# EAGLE design boost (EAGLE 9.1.0)
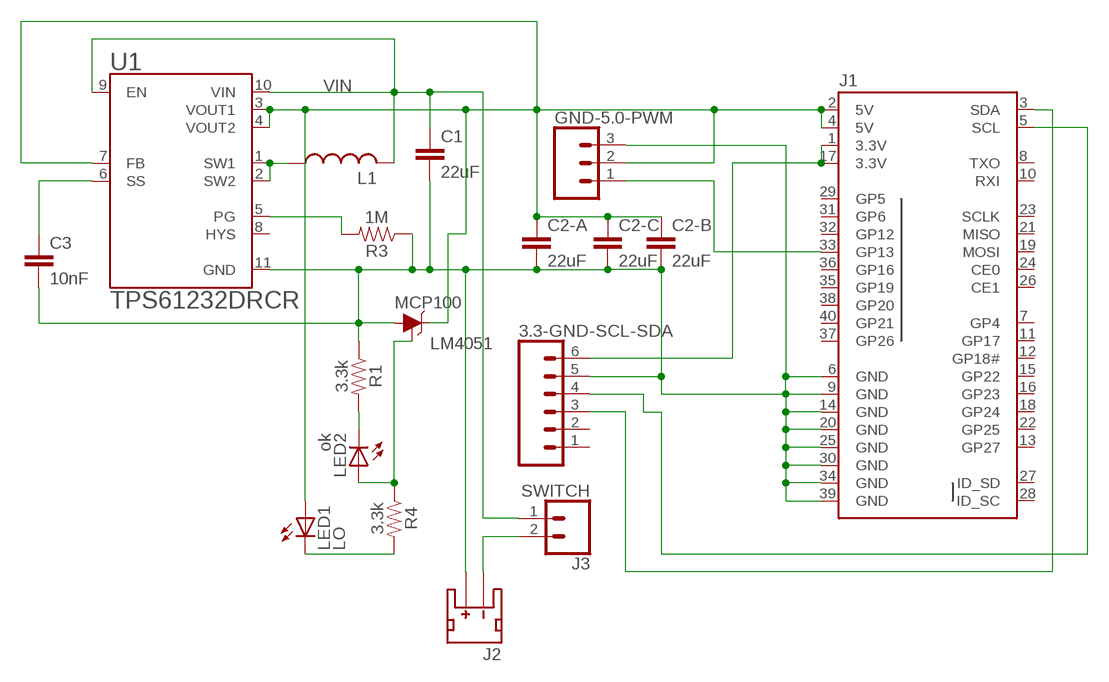
[diagram p0: schematic, sheet 1]

## Parts
3.3-GND-SCL-SDA  CONN_06POLAR  [MOLEX-1X6]
C1  22uF  C-EUC0603  [C0603]
C2-A  22uF  C-EUC0603  [C0603]
C2-B  22uF  C-EUC0603  [C0603]
C2-C  22uF  C-EUC0603  [C0603]
C3  10nF  C-EUC0603  [C0603]
GND-5.0-PWM  CONN_03  [1X03]
J1  RASPBERRYPI-40-PIN-GPIO_PTH_NO_SHROUD  [2X20]
J2  PWR  JST_2MM_MALE  [JST-2-SMD]
J3  SWITCH  CONN_02  [1X02]
L1  L-USL4532C  [L4532M]
LED1  LO  LEDCHIP-LED0603  [CHIP-LED0603]
LED2  ok  LEDCHIP-LED0603  [CHIP-LED0603]
MCP100  LM4051  [SOT23-3]
R1  3.3k  3.3KOHM-0603-1/10W-1%  [0603]
R3  1M  1.5KOHM-0603-1/10W-1%  [0603]
R4  3.3k  3.3KOHM-0603-1/10W-1%  [0603]
U1  TPS61232DRCR  [SON50P300X300X100-10N]

## Nets
GND: 3.3-GND-SCL-SDA.5 C1.2 C2-A.2 C2-B.2 C2-C.2 C3.2 GND-5.0-PWM.3 J1.6(GND) J1.9(GND) J1.14(GND) J1.20(GND) J1.25(GND) J1.30(GND) J1.34(GND) J1.39(GND) J2.2(+) MCP100.3(A) R1.1 R3.1 U1.11(GND)
N$1: LED2.C R1.2
N$4: LED2.A MCP100.1(ADJ) R4.1
N$9: GND-5.0-PWM.1 J1.33(GP13)
N$13: LED1.C R4.2
N$22: J2.1(-) J3.2
PG: R3.2 U1.5(PG)
SCL: 3.3-GND-SCL-SDA.4 J1.5(SCL)
SDA: 3.3-GND-SCL-SDA.3 J1.3(SDA)
SS: C3.1 U1.6(SS)
SW: L1.1 U1.1(SW1) U1.2(SW2)
V33: 3.3-GND-SCL-SDA.6 J1.1(3.3V) J1.17(3.3V)
VIN: C1.1 J3.1 L1.2 U1.9(EN) U1.10(VIN)
VOUT: C2-A.1 C2-B.1 C2-C.1 GND-5.0-PWM.2 J1.2(5V) J1.4(5V) LED1.A MCP100.2(C) U1.3(VOUT1) U1.4(VOUT2) U1.7(FB)
Unconnected: 3.3-GND-SCL-SDA.1 3.3-GND-SCL-SDA.2 J1.7(GP4) J1.8(TXO) J1.10(RXI) J1.11(GP17) J1.12(GP18#) J1.13(GP27) J1.15(GP22) J1.16(GP23) J1.18(GP24) J1.19(MOSI) J1.21(MISO) J1.22(GP25) J1.23(SCLK) J1.24(CE0) J1.26(CE1) J1.27(ID_SD) J1.28(ID_SC) J1.29(GP5) J1.31(GP6) J1.32(GP12) J1.35(GP19) J1.36(GP16) J1.37(GP26) J1.38(GP20) J1.40(GP21) J2.NC1(PAD1) J2.NC2(PAD2) U1.8(HYS)

## Library data of the parts
3.3-GND-SCL-SDA = SparkFun-Connectors:CONN_06: Multi connection point. Often used as Generic Header-pin footprint for 0.1 inch spaced/style header connections On any of the 0.1 inch spaced packages, you can populate with these: Break Away Headers - Straight <https://www.sparkfun.com/products/116> (PRT-00116) Break Away Male Headers - Right Angle <https://www.sparkfun.com/products/553> (PRT-00553) Female Headers <https://www.sparkfun.com/products/115> (PRT-00115) Break Away Headers - Machine Pin <https://www.sparkfun.com/products/117> (PRT-00117) Break Away Female Headers - Swiss Machine Pin <https://www.sparkfun.com/products/743> (PRT-00743) Arduino Stackable Header - 6 Pin <https://www.sparkfun.com/products/9280> (PRT-09280) For SCREWTERMINALS and SPRING TERMINALS visit here: Screw Terimnals on SparkFun.com <https://www.sparkfun.com/search/results?term=Screw+Terminals> (5mm/3.5mm/2.54mm spacing) This device is also useful as a general connection point to wire up your design to another part of your project. Our various solder wires solder well into these plated through hole pads. Hook-Up Wire - Assortment (Stranded, 22 AWG) <https://www.sparkfun.com/products/11375> (PRT-11375) Hook-Up Wire - Assortment (Solid Core, 22 AWG) <https://www.sparkfun.com/products/11367> (PRT-11367) View the entire wire category on our website here <https://www.sparkfun.com/categories/141>
C1 C2-A C2-B C2-C C3 = rcl:C-EU: CAPACITOR, European symbol; SPICEPREFIX: C
GND-5.0-PWM = SparkFun-Connectors:CONN_03: Multi connection point. Often used as Generic Header-pin footprint for 0.1 inch spaced/style header connections On any of the 0.1 inch spaced packages, you can populate with these: Break Away Headers - Straight <https://www.sparkfun.com/products/116> (PRT-00116) Break Away Male Headers - Right Angle <https://www.sparkfun.com/products/553> (PRT-00553) Female Headers <https://www.sparkfun.com/products/115> (PRT-00115) Break Away Headers - Machine Pin <https://www.sparkfun.com/products/117> (PRT-00117) Break Away Female Headers - Swiss Machine Pin <https://www.sparkfun.com/products/743> (PRT-00743) Stackable Header - 3 Pin (Female, 0.1") <https://www.sparkfun.com/products/13875> (PRT-13875) For SCREWTERMINALS and SPRING TERMINALS visit here: Screw Terimnals on SparkFun.com <https://www.sparkfun.com/search/results?term=Screw+Terminals> (5mm/3.5mm/2.54mm spacing) This device is also useful as a general connection point to wire up your design to another part of your project. Our various solder wires solder well into these plated through hole pads. Hook-Up Wire - Assortment (Stranded, 22 AWG) <https://www.sparkfun.com/products/11375> (PRT-11375) Hook-Up Wire - Assortment (Solid Core, 22 AWG) <https://www.sparkfun.com/products/11367> (PRT-11367) View the entire wire category on our website here <https://www.sparkfun.com/categories/141> Special notes: Molex polarized connector foot print use with SKU : PRT-08232 with associated crimp pins and housings.
J1 = SparkFun-Connectors:RASPBERRYPI-40-PIN-GPIO: Raspberry Pi GPIO Header 2x20 pin connector, as found on B, B+, A+ models. Both shrouded PTH and SMT versions available. SparkFun Products: GPIO Shrouded Header <https://www.sparkfun.com/products/13054>- PTH SparkFun Pi Wedge (Preassembled) <https://www.sparkfun.com/products/13717>
J2 = SparkFun-Connectors:JST_2MM_MALE: JST 2MM MALE RA CONNECTOR Two pin, compact surface mount connector. Commonly used as a battery input connection point. We really like the solid locking feeling and high current rating on these small connectors. We use these all the time as battery connectors. Mates to single-cell LiPo batteries. Here is the connector we sell at SparkFun: JST Right Angle Connector - White <https://www.sparkfun.com/products/8612> (PRT-08612) Datasheet <http://www.sparkfun.com/datasheets/Prototyping/Connectors/JST-Horizontal.pdf> It was used on these SparkFun products: SparkFun MOSFET Power Controller <https://www.sparkfun.com/products/11214> (PRT-11214) SparkFun Battery Babysitter - LiPo Battery Manager <https://www.sparkfun.com/products/13777> (PRT-13777) And many, many others that required a lipo battery connection.; PROD_ID: CONN-11443; SF_ID: PRT-08612
J3 = SparkFun-Connectors:CONN_02: Multi connection point. Often used as Generic Header-pin footprint for 0.1 inch spaced/style header connections On any of the 0.1 inch spaced packages, you can populate with these: Break Away Headers - Straight <https://www.sparkfun.com/products/116> (PRT-00116) Break Away Male Headers - Right Angle <https://www.sparkfun.com/products/553> (PRT-00553) Female Headers <https://www.sparkfun.com/products/115> (PRT-00115) Break Away Headers - Machine Pin <https://www.sparkfun.com/products/117> (PRT-00117) Break Away Female Headers - Swiss Machine Pin <https://www.sparkfun.com/products/743> (PRT-00743) For SCREWTERMINALS and SPRING TERMINALS visit here: Screw Terimnals on SparkFun.com <https://www.sparkfun.com/search/results?term=Screw+Terminals> (5mm/3.5mm/2.54mm spacing) This device is also useful as a general connection point to wire up your design to another part of your project. Our various solder wires solder well into these plated through hole pads. Hook-Up Wire - Assortment (Stranded, 22 AWG) <https://www.sparkfun.com/products/11375> (PRT-11375) Hook-Up Wire - Assortment (Solid Core, 22 AWG) <https://www.sparkfun.com/products/11367> (PRT-11367) View the entire wire category on our website here <https://www.sparkfun.com/categories/141> Special notes: Molex polarized connector foot print use with: PRT-08233 with associated crimp pins and housings. 2.54_SCREWTERM for use with PRT-10571. 3.5mm Screw Terminal footprints for PRT-08084 5mm Screw Terminal footprints for use with PRT-08432
L1 = rcl:L-US: INDUCTOR, American symbol; SPICEPREFIX: L
LED1 LED2 = led:LED: LED OSRAM: - CHIPLED LG R971, LG N971, LY N971, LG Q971, LY Q971, LO R971, LY R971 LH N974, LH R974 LS Q976, LO Q976, LY Q976 LO Q996 - Hyper CHIPLED LW Q18S LB Q993, LB Q99A, LB R99A - SideLED LS A670, LO A670, LY A670, LG A670, LP A670 LB A673, LV A673, LT A673, LW A673 LH A674 LY A675 LS A676, LA A676, LO A676, LY A676, LW A676 LS A679, LY A679, LG A679 - Hyper Micro SIDELED® LS Y876, LA Y876, LO Y876, LY Y876 LT Y87S - SmartLED LW L88C, LW L88S LB L89C, LB L89S, LG L890 LS L89K, LO L89K, LY L89K LS L896, LA L896, LO L896, LY L896 - TOPLED LS T670, LO T670, LY T670, LG T670, LP T670 LSG T670, LSP T670, LSY T670, LOP T670, LYG T670 LG T671, LOG T671, LSG T671 LB T673, LV T673, LT T673, LW T673 LH T674 LS T676, LA T676, LO T676, LY T676, LB T676, LH T676, LSB T676, LW T676 LB T67C, LV T67C, LT T67C, LS T67K, LO T67K, LY T67K, LW E67C LS E67B, LA E67B, LO E67B, LY E67B, LB E67C, LV E67C, LT E67C LW T67C LS T679, LY T679, LG T679 LS T770, LO T770, LY T770, LG T770, LP T770 LB T773, LV T773, LT T773, LW T773 LH T774 LS E675, LA E675, LY E675, LS T675 LS T776, LA T776, LO T776, LY T776, LB T776 LHGB T686 LT T68C, LB T68C - Hyper Mini TOPLED® LB M676 - Mini TOPLED Santana® LG M470 LS M47K, LO M47K, LY M47K Source: http://www.osram.convergy.de LUXEON: - LUMILED® LXK2-PW12-R00, LXK2-PW12-S00, LXK2-PW14-U00, LXK2-PW14-V00 LXK2-PM12-R00, LXK2-PM12-S00, LXK2-PM14-U00 LXK2-PE12-Q00, LXK2-PE12-R00, LXK2-PE12-S00, LXK2-PE14-T00, LXK2-PE14-U00 LXK2-PB12-K00, LXK2-PB12-L00, LXK2-PB12-M00, LXK2-PB14-N00, LXK2-PB14-P00, LXK2-PB14-Q00 LXK2-PR12-L00, LXK2-PR12-M00, LXK2-PR14-Q00, LXK2-PR14-R00 LXK2-PD12-Q00, LXK2-PD12-R00, LXK2-PD12-S00 LXK2-PH12-R00, LXK2-PH12-S00 LXK2-PL12-P00, LXK2-PL12-Q00, LXK2-PL12-R00 Source: www.luxeon.com KINGBRIGHT: KA-3528ASYC Source: www.kingbright.com
MCP100 = SparkFun-DiscreteSemi:LM4051: Adjustable Shunt Voltage Reference SOT-23 package without need for external capacitor. Adjustable from 1.24V to 10V. 60µA to 12mA SparkFun Products: SparkFun SparkPunk Sound Kit <https://www.sparkfun.com/products/11177> SparkFun ESP8266 Thing <https://www.sparkfun.com/products/13231>; PROD_ID: IC-13134
R1 R4 = SparkFun-Resistors:3.3KOHM: 3.3kΩ resistor A resistor is a passive two-terminal electrical component that implements electrical resistance as a circuit element. Resistors act to reduce current flow, and, at the same time, act to lower voltage levels within circuits. - Wikipedia; PROD_ID: RES-07851
R3 = SparkFun-Resistors:1.5KOHM: 1.5kΩ resistor A resistor is a passive two-terminal electrical component that implements electrical resistance as a circuit element. Resistors act to reduce current flow, and, at the same time, act to lower voltage levels within circuits. - Wikipedia; PROD_ID: RES-08306; VALUE: 1.5k
U1 = steveo:TPS61232DRCR: High Efficiency Synchronous Step Up Converter With 5A Switch 10-VSON -40 to 85; DESCRIPTION: High Efficiency Synchronous Step Up Converter With 5A Switch 10-VSON -40 to 85; DIGI-KEY_PART_NUMBER: 296-44498-1-ND; DIGI-KEY_PURCHASE_URL: https://www.digikey.com/product-detail/en/texas-instruments/TPS61232DRCR/296-44498-1-ND/6110782?utm_source=snapeda&utm_medium=aggregator&utm_campaign=symbol; MF: Texas Instruments; MP: TPS61232DRCR; PACKAGE: VSON-10 Texas Instruments

## Board
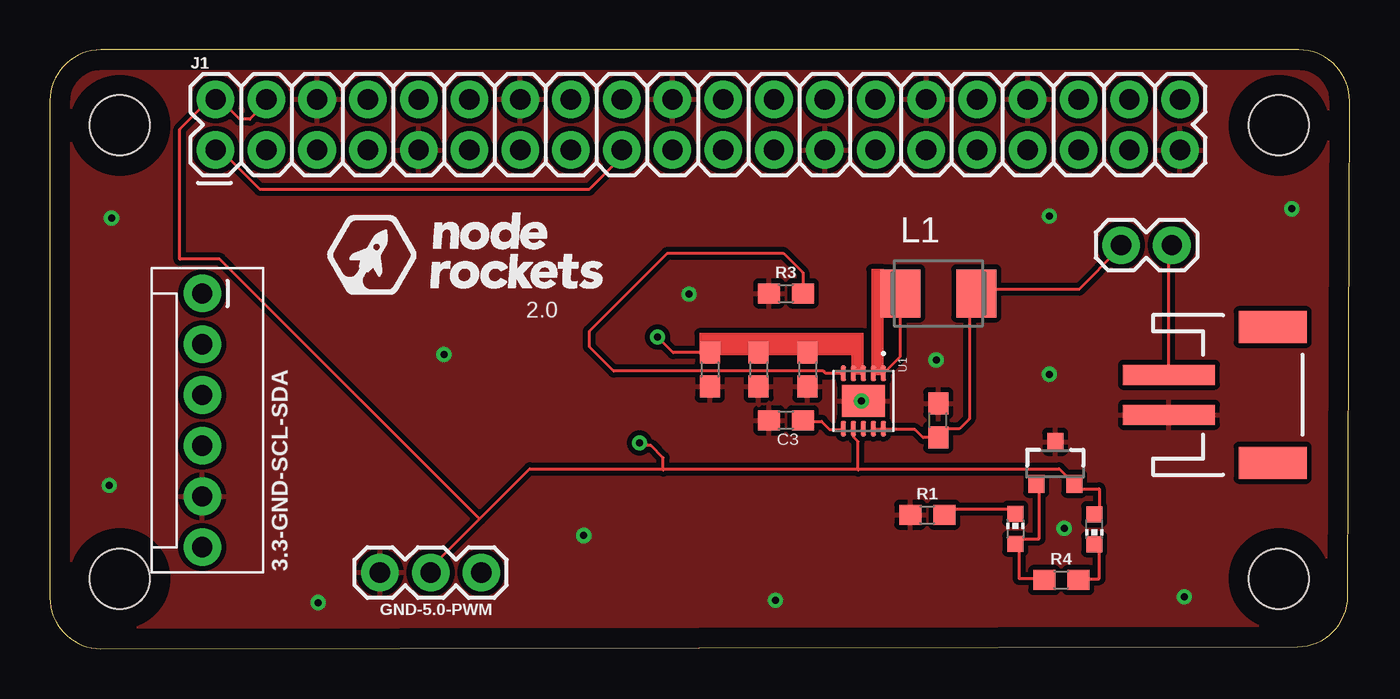
[diagram p1: board, top side]
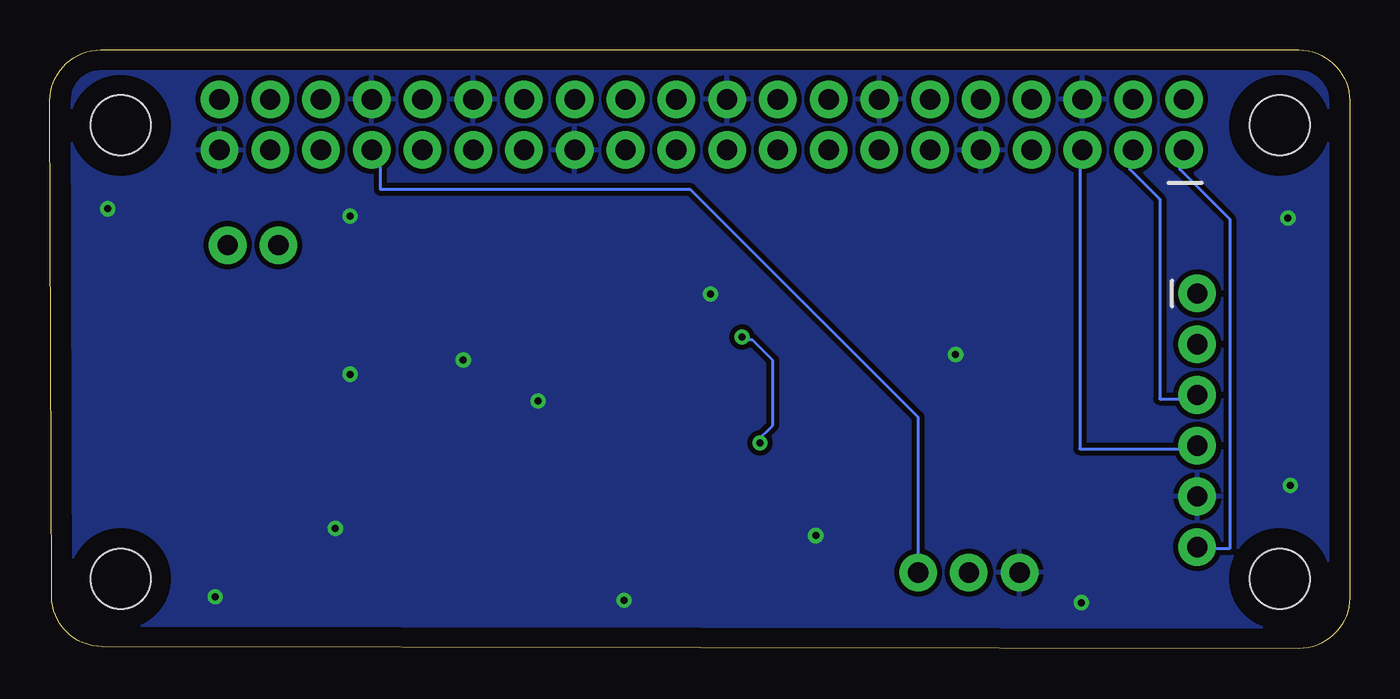
[diagram p2: board, bottom side, seen from below]

Size 65.03 x 29.97 mm. Coordinates in mm from the lower left corner, seen from the top.
Outline: 0,27.43 0,2.54 arc90 2.54,0 62.41,0.09 arc90 64.95,2.62 65.03,27.42 arc90 62.49,29.97 2.54,29.97 arc90 0,27.43
Copper layers (1*16): Top 0.035mm / dielectric 1.5mm / Bottom 0.035mm
Design rules "default *": minimum track width 6mil, minimum drill 0.35mm, track to track 10mil, track to pad 6mil, pad to pad 6mil, via to via 6mil, smd to smd 6mil, copper to edge 40mil, drill to drill 6mil, minimum pad ring 10mil, minimum via ring 8mil, stop-mask expansion 4mil, vias tented up to drill 0mil, thermal gap 10mil
Holes 3 mm at 3.5,26.2 61.5,26.2 61.5,3.5 3.5,3.5

### Footprints (pad centres in the part's own frame; a part is rotated, then mirrored left to right if it is on the bottom)
MOLEX-1X6 = drill 1.016 pad 1.88: 1 0,0; 2 2.54,0; 3 5.08,0; 4 7.62,0; 5 10.16,0; 6 12.7,0
C0603 = smd 1.1 x 1: 1 -0.85,0; 2 0.85,0
1X03 = drill 1.016 pad 1.88: 1 0,0; 2 2.54,0; 3 5.08,0
2X20 = drill 1.016 pad 1.88: 1 0,0; 2 0,2.54; 3 2.54,0; 4 2.54,2.54; 5 5.08,0; 6 5.08,2.54; 7 7.62,0; 8 7.62,2.54; 9 10.16,0; 10 10.16,2.54; 11 12.7,0; 12 12.7,2.54; 13 15.24,0; 14 15.24,2.54; 15 17.78,0; 16 17.78,2.54; 17 20.32,0; 18 20.32,2.54; 19 22.86,0; 20 22.86,2.54; 21 25.4,0; 22 25.4,2.54; 23 27.94,0; 24 27.94,2.54; 25 30.48,0; 26 30.48,2.54; 27 33.02,0; 28 33.02,2.54; 29 35.56,0; 30 35.56,2.54; 31 38.1,0; 32 38.1,2.54; 33 40.64,0; 34 40.64,2.54; 35 43.18,0; 36 43.18,2.54; 37 45.72,0; 38 45.72,2.54; 39 48.26,0; 40 48.26,2.54
JST-2-SMD = smd 1 x 4.6: 1 -1,-3.7; 2 1,-3.7 | smd 1.6 x 3.4: NC1 -3.4,1.5; NC2 3.4,1.5
1X02 = drill 1.016 pad 1.88: 1 0,0; 2 2.54,0
L4532M = smd 2 x 2.4: 1 -1.9,0; 2 1.9,0
CHIP-LED0603 = smd 0.8 x 0.8: A 0,-0.75; C 0,0.75
SOT23-3 = smd 0.8 x 0.9: 1 -0.95,-1; 2 0.95,-1; 3 0,1.1
0603 = smd 1.1 x 1: 1 -0.85,0; 2 0.85,0
SON50P300X300X100-10N = smd 0.76 x 0.26: 1 -1.385,1; 2 -1.385,0.5; 3 -1.385,0; 4 -1.385,-0.5; 5 -1.385,-1; 6 1.385,-1; 7 1.385,-0.5; 8 1.385,0; 9 1.385,0.5; 10 1.385,1 | smd 1.6 x 2.15: 11 0,0

### Placement (x,y rotation side)
3.3-GND-SCL-SDA  7.62,17.78 270 top
C1  44.45,11.43 90 top
C2-A  33.02,13.97 270 top
C2-B  37.9,13.97 270 top
C2-C  35.46,13.97 270 top
C3  36.83,11.43 180 top
GND-5.0-PWM  21.59,3.81 180 top
J1  8.29,24.96 0 top
J2  59.69,12.7 270 top
J3  53.6,20.2 0 top
L1  44.45,17.78 0 top
LED1  52.26,5.98 180 top
LED2  48.3,6 0 top
MCP100  50.3,9.25 0 top
R1  43.9,6.7 0 top
R3  36.83,17.78 0 top
R4  50.6,3.44 0 top
U1  40.7,12.4 270 top

### Tracks (layer width: path | path; a pad name or v marks a point on that pad's centre or on a via)
GND  (via drill 0.35)
  other vias: 40.6,12.4 3.08,21.55 2.96,8.16 13.42,2.3 36.3,2.42 26.71,5.66 19.71,14.73 31.98,17.76 44.35,14.44 50.02,21.66 50.02,13.73 62.14,22.01 56.76,2.6 50.75,6.02
  pour Top: 0.2,29.8 0.2,2.84 arc90 2.74,0.3 62.06,0.3 arc90 64.6,2.84 64.6,27.16 arc90 62.06,29.7 0.44,29.7 arc-45
  pour Bottom: 64.5,27.06 64.5,3.34 arc-90 61.96,0.8 2.84,0.8 arc-90 0.3,3.34 0.3,27.06 arc-90 2.84,29.6 61.96,29.6 arc-90
N$1
  Top 0.152: LED2.C 48,7 45,7 R1.2
N$4
  Top 0.152: R4.1 49.5,3.5 48.5,3.5 48.5,5 LED2.A 48.5,5.5 49.5,5.5 49.5,8 MCP100.1
N$9
  Bottom 0.152: J1.33 48.5,24.5 48.5,23 33,23 21.59,11.59 GND-5.0-PWM.1
N$13
  Top 0.152: LED1.C 52.5,5 52.5,3.5 51.5,3.5 R4.2
N$22
  Top 0.152: J3.2 56,20 56,14 J2.1
PG
  Top 0.152: U1.5 38.81,13.78 38.7,13.9 28.2,13.9 27,15.1 27,15.9 30.9,19.8 36.7,19.8 37.68,18.82 R3.2
SCL
  Bottom 0.152: 3.3-GND-SCL-SDA.4 8,10 13.5,10 13.5,24.5 J1.5
SDA
  Bottom 0.152: 3.3-GND-SCL-SDA.3 8,12.5 9.5,12.5 9.5,22.5 11,24 11,24.5 J1.3
SS
  Top 0.152: U1.6 39.62,10.97 39.01,10.97 38.61,11.38 37.8,11.38 C3.1
SW
  Top 0.152: U1.2 U1.1 42.55,14.63 L1.1
V33
  Top 0.152: J1.17 28.5,24.5 27,23 10.5,23 9,24.5 8.5,24.5 J1.1
  Bottom 0.152: 3.3-GND-SCL-SDA.6 7.5,5 6,5 6,21.5 8.5,24 8.5,24.5 J1.1
VIN
  Top 0.152: J3.1 53.5,20 51.5,18 46.5,18 L1.2 46,17.5 46,11.5 45.5,11 44.5,11 C1.1 44.3,10.56 43.69,10.56 43.28,10.97 41.66,10.97 | 41.66,10.97 41.25,10.97 U1.9 | 41.66,10.97 U1.10 41.66,10.97
VOUT  (via drill 0.35)
  Top 0.152: J1.4 11,27.5 10,26.5 9.5,26.5 8.5,27.5 J1.2 8,27.5 6.5,26 6.5,19.5 8.5,19.5 21.5,6.5 | LED1.A 52.5,7 52.5,8 51.5,8 MCP100.2 51,8.5 50.5,9 40.44,9 | 30.68,9 24,9 21.5,6.5 | 30.68,9 40.44,9 | 21.5,6.5 19,4 GND-5.0-PWM.2 | 30.68,9 30.68,8.94 30.68,9 | 30.68,9 30.68,9.55 30.07,10.16 29.67,10.16 v29.5,10.3 | 40.44,9 40.44,8.94 40.44,9 | 40.44,9 40.44,10.36 40.23,10.56 40.23,10.97 U1.7 | v30.4,15.6 31.18,14.82 C2-A.1 C2-C.1 C2-B.1 38.18,15.1 40.3,15.1 40.3,13.88 U1.4 U1.3
  Bottom 0.152: v30.4,15.6 30.28,15.44 29.87,15.44 28.85,14.42 28.85,11.17 29.67,10.36 v29.5,10.3
(copper drawn outside any net)
  shapes: Top area x3

### Text on the board
tPlace: 2.0 | /Users/olsonsd/Documents/EAGLE/projects/rocketboost/node-rockets.BMP